# EAGLE design RFM12B-V1.2-SMD (EAGLE 6.6.0)
ABBREV: rf1; PROJECT: RFM12B Board
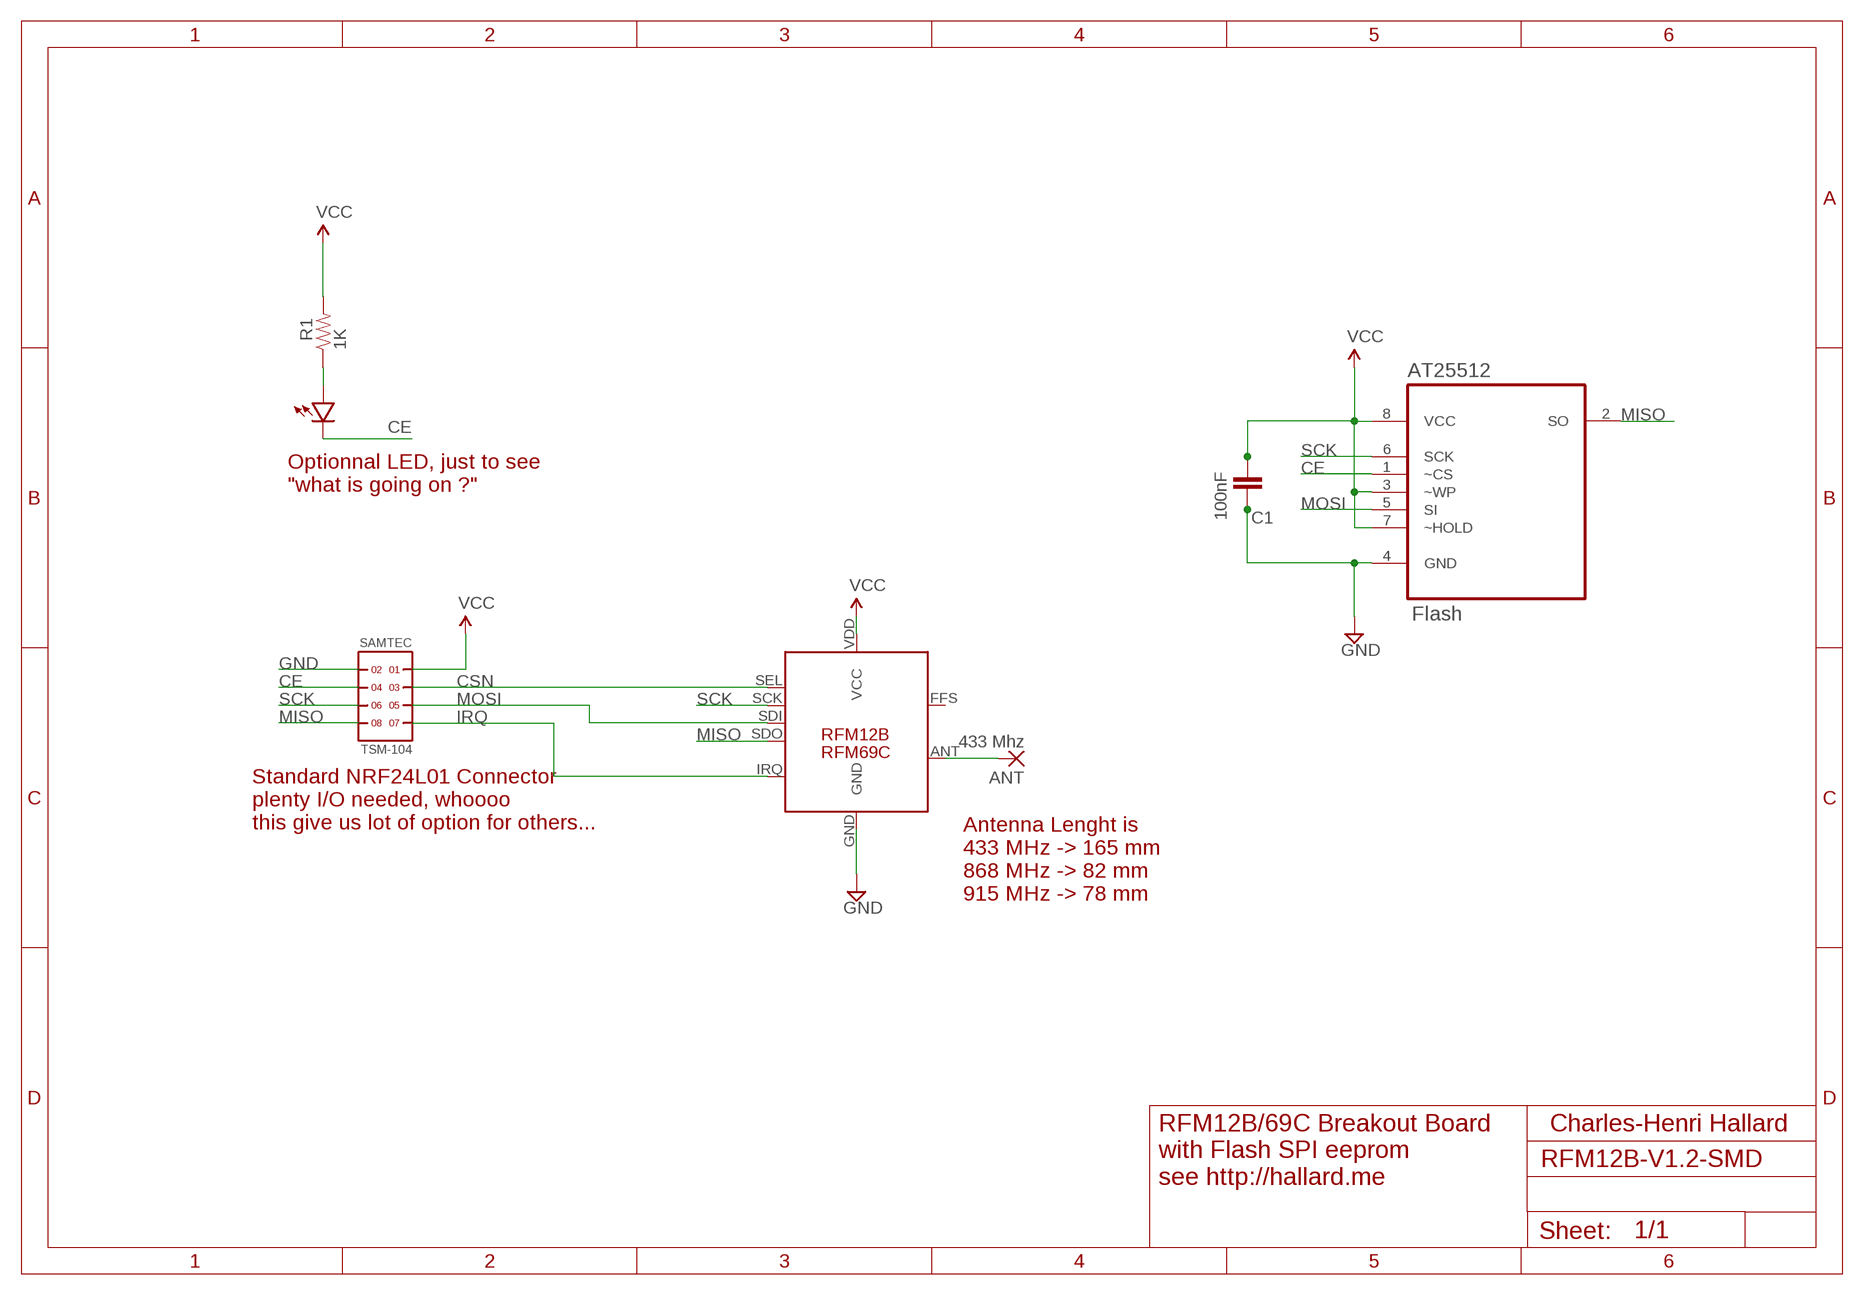
[diagram p0: schematic, sheet 1]

## Parts
ANT  433 Mhz  1,6/0,8  [1,6/0,8]
AT25512  Flash  AT25512N-SH-B  [SOIC127P600X175-8N]
C1  100nF  CAP0805-CAP  [0805-CAP]
R1  1K  RESISTOR0805-RES  [0805-RES]
SAMTEC  TSM-104  [TSM-104]
U$2  RFM12B  [RFM12B]
U$3  LED0805-LARGE  [0805-LED-LARGEPADS]

## Nets
CE: AT25512.1(~CS) SAMTEC.4 U$3.MINUS
CSN: SAMTEC.3 U$2.SEL
GND [power]: AT25512.4(GND) C1.2 SAMTEC.2 U$2.GND
IRQ: SAMTEC.7 U$2.IRQ
MISO: AT25512.2(SO) SAMTEC.8 U$2.SDO
MOSI: AT25512.5(SI) SAMTEC.5 U$2.SDI
N$1: ANT.1(P) U$2.ANT
N$2: R1.1 U$3.PLUS
SCK: AT25512.6(SCK) SAMTEC.6 U$2.SCK
VCC [power]: AT25512.3(~WP) AT25512.7(~HOLD) AT25512.8(VCC) C1.1 R1.2 SAMTEC.1 U$2.VDD(VCC)
Unconnected: U$2.FFS

## Notes on the sheet
- Optionnal LED, just to see
  "what is going on ?"
- RFM69C
- Standard NRF24L01 Connector
  plenty I/O needed, whoooo
  this give us lot of option for others...
- Antenna Lenght is
  433 MHz -> 165 mm
  868 MHz -> 82 mm
  915 MHz -> 78 mm
- Charles-Henri Hallard
- RFM12B/69C Breakout Board
  with Flash SPI eeprom
  see http://hallard.me

## Library data of the parts
ANT = JeeLabs:1,6/0,8: THROUGH-HOLE PAD
AT25512 = Atmel_By_element14_Batch_1:AT25512N-SH-B: SPI Serial EEPROM; MPN: AT25512N-SH-B; OC_FARNELL: 1841581; OC_NEWARK: 12T1360; PACKAGE: SOIC-8; SUPPLIER: Atmel
C1 = _c2h:CAP: Capacitor Standard 0603 ceramic capacitor, and 0.1" leaded capacitor.
R1 = _c2h:RESISTOR: Resistor Basic schematic elements and footprints for 0603, 1206, and PTH resistors.
SAMTEC = _c2h:TSM-104
U$2 = lh-library:RFM12B
U$3 = _c2h:LED

## Net classes
1 power: width 0.203 mm, drill 0.305 mm, clearance 0.152 mm

## Board
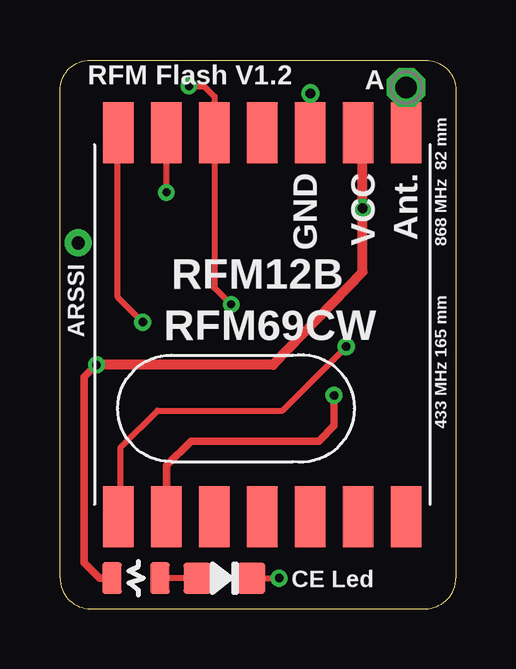
[diagram p1: board, top side]
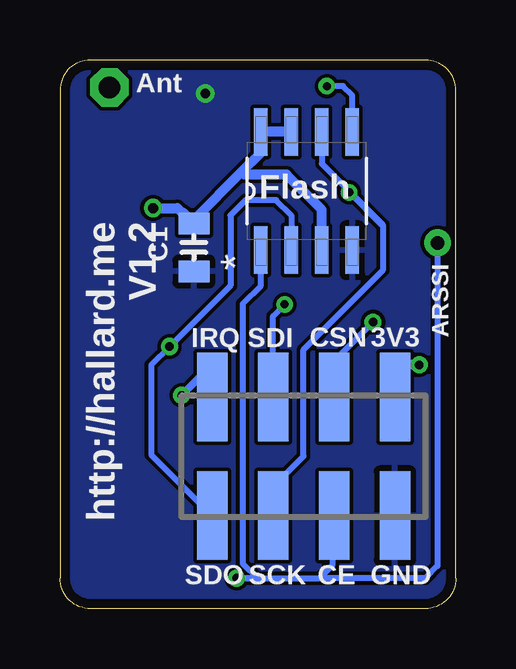
[diagram p2: board, bottom side, seen from below]

Size 16.51 x 22.86 mm. Coordinates in mm from the lower left corner, seen from the top.
Outline: 0,21.59 0,1.27 arc90 1.27,0 15.24,0 arc90 16.51,1.27 16.51,21.59
Outline: 0,21.59 0,21.64
Outline: 16.51,21.64 16.51,21.59
Outline: 0,21.59 arc-90 1.27,22.86 15.24,22.86 arc-90 16.51,21.59
Copper layers (1*16): Top 0.0356mm / dielectric 1.5011mm / Bottom 0.0356mm
Design rules "LaenPCBOrder *": minimum track width 6mil, minimum drill 13mil, track to track 6mil, track to pad 6mil, pad to pad 6mil, via to via 6mil, smd to smd 6mil, copper to edge 15mil, drill to drill 6mil, minimum pad ring 7mil, minimum via ring 7mil, stop-mask expansion 30mil, vias tented up to drill 100mil, thermal gap 10mil

### Footprints (pad centres in the part's own frame; a part is rotated, then mirrored left to right if it is on the bottom)
1,6/0,8 = drill 0.9 pad 1.6 octagon: 1 0,0
SOIC127P600X175-8N = smd 1.981 x 0.559: 1 -2.464,1.905; 2 -2.464,0.635; 3 -2.464,-0.635; 4 -2.464,-1.905; 5 2.464,-1.905; 6 2.464,-0.635; 7 2.464,0.635; 8 2.464,1.905
0805-CAP = smd 0.902 x 1.3: 1 -1,0; 2 1,0
0805-RES = smd 0.8 x 1.3: 1 -1,0; 2 1,0
TSM-104 = smd 1.27 x 3.683: 1 -3.81,-2.477; 2 -3.81,2.477; 3 -1.27,-2.477; 4 -1.27,2.477; 5 1.27,-2.477; 6 1.27,2.477; 7 3.81,-2.477; 8 3.81,2.477
RFM12B = smd 2.54 x 1.27: ANT 8,-6; FFS -8,2; GND 8,-2; IRQ -8,4; P$8 -8,0; P$9 -8,-2; P$10 -8,-4; P$12 -8,-6; P$16 8,0; SCK 8,4; SDI 8,2; SDO -8,6; SEL 8,6; VDD 8,-4
0805-LED-LARGEPADS = smd 1.156 x 1.3: MINUS -1.127,0; PLUS 1.127,0

### Placement (x,y rotation side)
ANT  14.44,21.72 0 top
AT25512  6.22,17.4 90 bottom
C1  10.92,15.05 270 bottom
R1  3.17,1.27 180 top
SAMTEC  6.35,6.35 180 bottom
U$2  8.45,11.84 90 top
U$3  6.86,1.27 180 top

### Tracks (layer width: path | path; a pad name or v marks a point on that pad's centre or on a via)
CE  (via drill 0.36 pad 0.71, 0.56 pad 1.12)
  Top 0.254: U$3.MINUS v9.14,1.27
  Bottom 0.254: AT25512.1 8.13,13.46 8.89,12.7 8.89,1.88 8.28,1.27 v9.14,1.27 5.69,1.27 | 5.69,1.27 5.13,1.83 5.13,3.82 SAMTEC.4 | v0.76,15.24 0.76,1.78 1.27,1.27 5.69,1.27
CSN  (via drill 0.36 pad 0.71)
  Top 0.203: 2.41,19.8 U$2.SEL
  Top 0.254: 2.41,19.8 2.41,12.98 v3.45,11.94
  Bottom 0.254: v3.45,11.94 5.08,10.31 SAMTEC.3
GND  (via drill 0.41)
  Top 0.381: U$2.GND 10.45,20.47 10.44,20.47
  Top 0.406: U$2.GND 10.45,19.42 v10.45,21.46
  pour Bottom: -1.08,-1.08 -1.08,23.23 17.84,23.23 17.84,-1.08
IRQ  (via drill 0.36 pad 0.71)
  Top 0.203: U$2.IRQ 4.45,3.05
  Top 0.254: U$2.IRQ
  Top 0.305: U$2.IRQ 4.45,5.97 5.46,6.99 10.79,6.99 11.43,7.62 v11.43,8.89
  Bottom 0.305: v11.43,8.89 10.16,10.16 SAMTEC.7
MISO  (via drill 0.36 pad 0.71)
  Top 0.254: U$2.SDO 2.51,3.84 2.54,3.81 2.54,6.73 4.06,8.26 9.27,8.26 v11.94,10.92
  Bottom 0.254: AT25512.2 6.86,16.38 7.49,17.02 8.76,17.02 9.4,16.38 9.4,13.46 v11.94,10.92 12.7,10.16 12.7,6.41 SAMTEC.8
MOSI  (via drill 0.33)
  Top 0.254: v5.38,21.77 6.02,21.77 6.45,21.34 U$2.SDI 6.45,13.37 v7.14,12.68
  Bottom 0.254: AT25512.5 4.32,21.39 4.7,21.77 v5.38,21.77 | SAMTEC.5 7.62,12.19 v7.14,12.68
N$1
  Top 0.203: U$2.ANT 14.45,20.61 14.44,20.61
  Top 0.254: ANT.1 14.44,20.61
N$2
  Top 0.254: U$3.PLUS R1.1
SCK  (via drill 0.33)
  Top 0.254: v4.45,17.35 U$2.SCK
  Bottom 0.254: SAMTEC.6 7.62,5.08 6.35,6.35 6.35,10.79 3.05,14.1 3.05,16 | AT25512.6 5.59,18.54 3.05,16 | 3.05,16 3.1,16 v4.45,17.35
VCC  (via drill 0.36 pad 0.71, 0.41)
  Top 0.305: R1.2 1.65,1.27 1.02,1.91 1.02,9.65 v1.52,10.16
  Top 0.381: 12.45,20.66 U$2.VDD
  Top 0.406: 12.57,19.71 U$2.VDD 12.7,19.58 12.7,19.05 12.62,18.97 v12.62,16.69 12.62,14.02 8.89,10.16 v1.52,10.16
  Bottom 0.254: 2.54,10.16 SAMTEC.1
  Bottom 0.406: AT25512.7 AT25512.8 8.15,19.84 8.15,18.97 8.93,18.2 | 8.93,18.2 10.92,16.2 C1.1 11.38,16.51 11.43,16.51 11.61,16.69 v12.62,16.69 | 8.93,18.2 8.81,18.09 7.06,18.09 5.59,16.61 AT25512.3 | v1.52,10.16 2.54,10.16

### Text on the board
tNames: RFM Flash V1.2 | A | GND | VCC | Ant. | 868 MHz 82 mm | ARSSI | RFM69CW | 433 MHz 165 mm | CE Led
bNames: Ant | http://hallard.me / V1.2 | ARSSI | 3V3 | CSN | SDI | IRQ | GND | CE | SCK | SDO